# EAGLE design Bench (EAGLE 9.3.1)

## Sheet 1 of 2
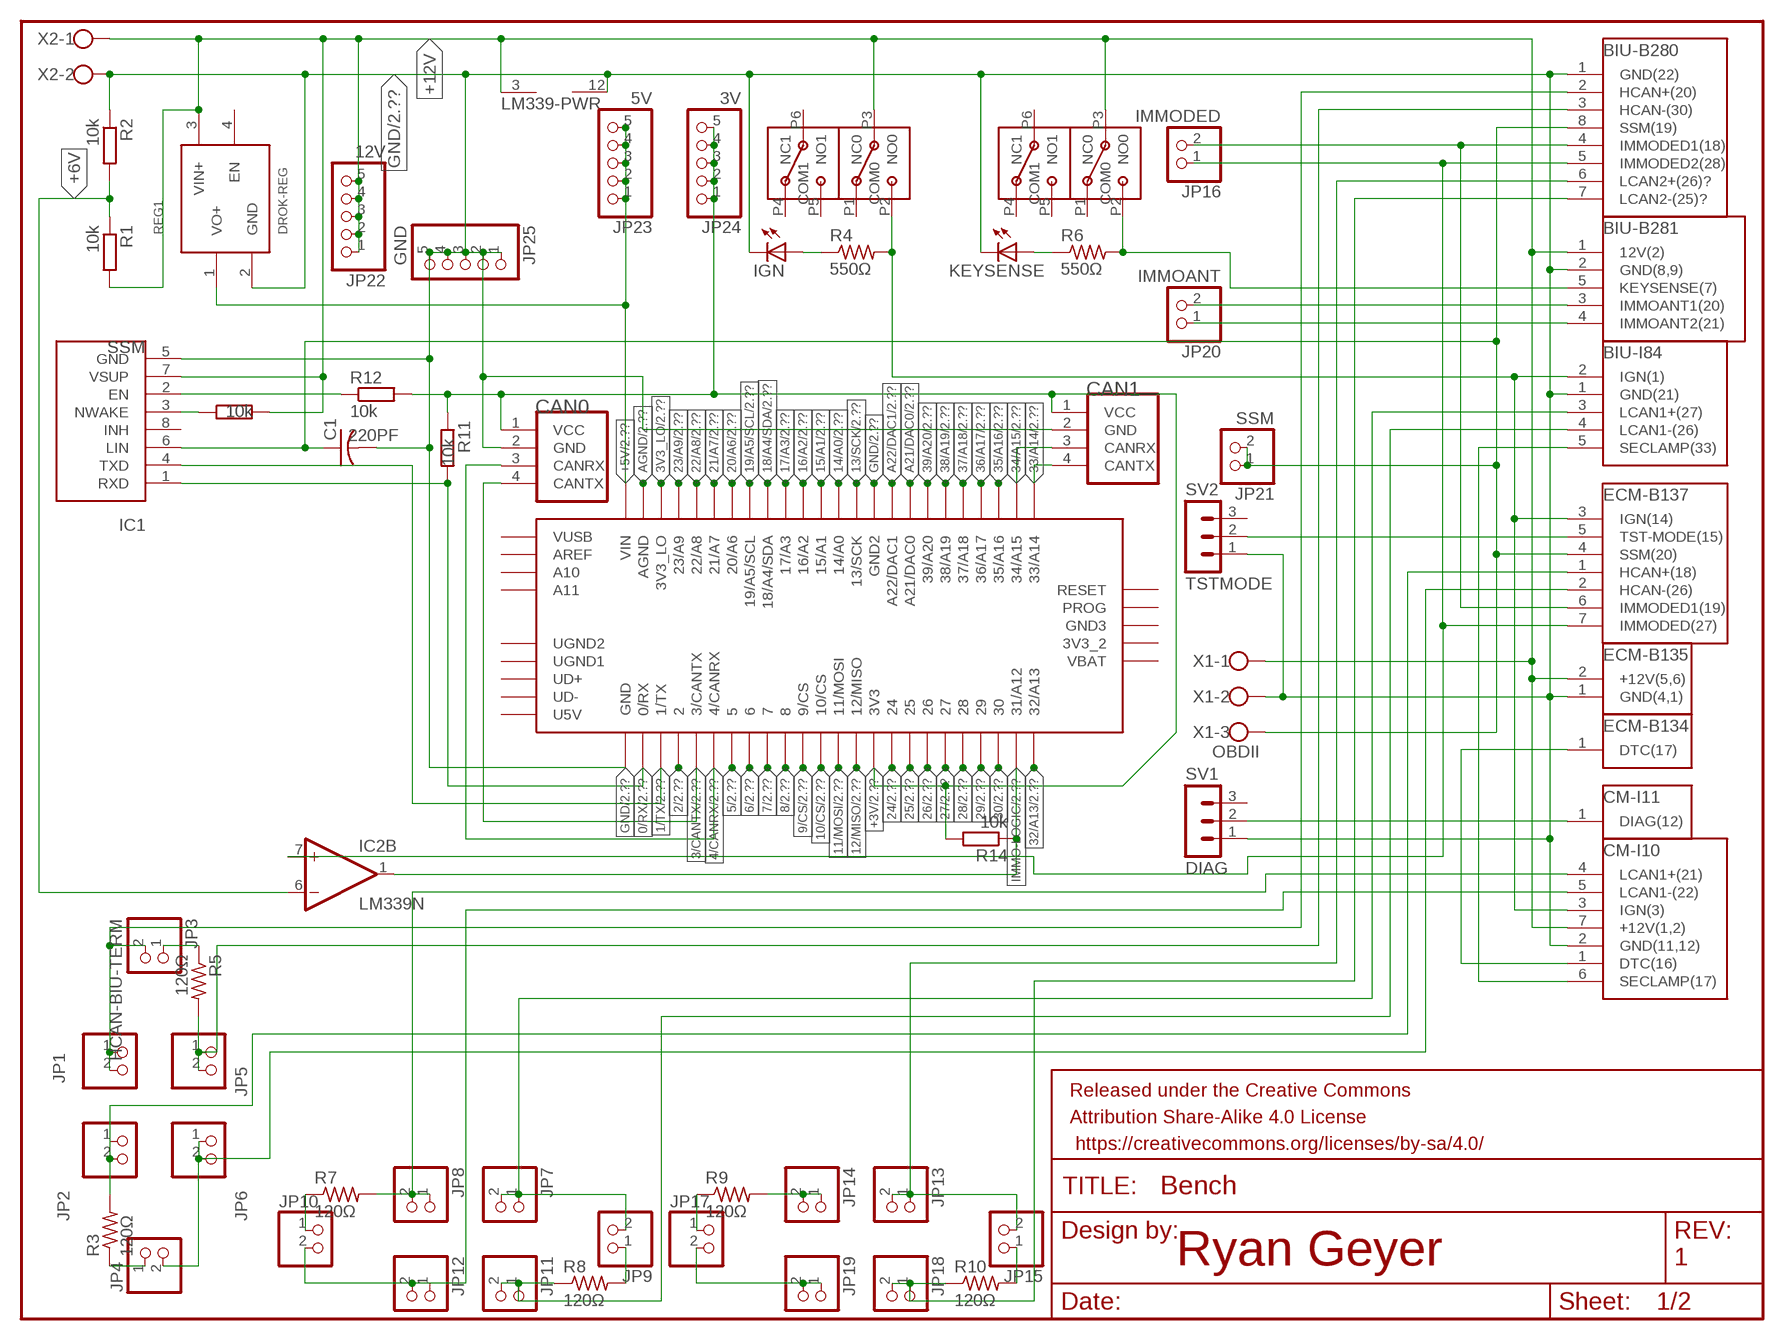
[diagram p0: schematic, sheet 1]

### Parts
C1  220PF  C-US050-024X044  [C050-024X044]
CAN0  SN65HVD230D-BREAKOUT  [1X04]
CAN1  SN65HVD230D-BREAKOUT  [1X04]
CONN1  CM-110  [CM-110]
CONN2  CM-I11  [ECM-B134]
CONN3  BIU-B280  [BIU-B280]
CONN4  BIU-B281  [BIU-B281]
CONN5  BIU-I84  [BIU-I84]
CONN6  ECM-B135  [ECM-B135]
CONN7  ECM-B137  [ECM-B137]
CONN8  ECM-B134  [ECM-B134]
FRAME1  FRAME-LETTER  [CREATIVE_COMMONS]
IC1  SSM  SN65HDVA195-Q1DIL8  [DIL8]
IC2  LM339N  [DIL14]
IGN  LED3MM  [LED3MM]
JP1  PINHD-1X2  [1X02]
JP2  PINHD-1X2  [1X02]
JP3  HCAN-BIU-TERM  PINHD-1X2  [1X02]
JP4  PINHD-1X2  [1X02]
JP5  PINHD-1X2  [1X02]
JP6  PINHD-1X2  [1X02]
JP7  PINHD-1X2  [1X02]
JP8  PINHD-1X2  [1X02]
JP9  PINHD-1X2  [1X02]
JP10  PINHD-1X2  [1X02]
JP11  PINHD-1X2  [1X02]
JP12  PINHD-1X2  [1X02]
JP13  PINHD-1X2  [1X02]
JP14  PINHD-1X2  [1X02]
JP15  PINHD-1X2  [1X02]
JP16  IMMODED  PINHD-1X2  [1X02]
JP17  PINHD-1X2  [1X02]
JP18  PINHD-1X2  [1X02]
JP19  PINHD-1X2  [1X02]
JP20  IMMOANT  PINHD-1X2  [1X02]
JP21  SSM  PINHD-1X2  [1X02]
JP22  12V  PINHD-1X5  [1X05]
JP23  5V  PINHD-1X5  [1X05]
JP24  3V  PINHD-1X5  [1X05]
JP25  GND  PINHD-1X5  [1X05]
KEYSENSE  LED3MM  [LED3MM]
MCU1  TEENSY_3.5/3.6  [TEENSY_3.5/3.6]
R1  10k  R0207/10  [0207/10]
R2  10k  R0207/10  [0207/10]
R3  120Ω  R-US_0207/10  [0207/10]
R4  550Ω  R-US_0207/10  [0207/10]
R5  120Ω  R-US_0207/10  [0207/10]
R6  550Ω  R-US_0207/10  [0207/10]
R7  120Ω  R-US_0207/10  [0207/10]
R8  120Ω  R-US_0207/10  [0207/10]
R9  120Ω  R-US_0207/10  [0207/10]
R10  120Ω  R-US_0207/10  [0207/10]
R11  10k  R0207/10  [0207/10]
R12  10k  R0207/10  [0207/10]
R13  10k  R0207/10  [0207/10]
R14  10k  R0207/10  [0207/10]
REG1  DROK-REG  [DROK-REG]
SV1  DIAG  MA03-1  [MA03-1]
SV2  TSTMODE  MA03-1  [MA03-1]
SW1  8MM-DPDT  [8MM-DPDT]
SW2  8MM-DPDT  [8MM-DPDT]
X1  OBDII  W237-103  [W237-103]
X2  GND  W237-102  [W237-102]

### Nets
0/RX: IC1.1(RXD) MCU1.0/RX R11.2 ; also sheet 2
1/TX: IC1.4(TXD) MCU1.1/TX ; also sheet 2
2: MCU1.2 ; also sheet 2
3/CANTX: CAN0.4(CANTX) MCU1.3/CANTX ; also sheet 2
3V3_LO: MCU1.3V3_LO ; also sheet 2
4/CANRX: CAN0.3(CANRX) MCU1.4/CANRX ; also sheet 2
5: MCU1.5 ; also sheet 2
6: MCU1.6 ; also sheet 2
7: MCU1.7 ; also sheet 2
8: MCU1.8 ; also sheet 2
9/CS: MCU1.9/CS ; also sheet 2
10/CS: MCU1.10/CS ; also sheet 2
11/MOSI: MCU1.11/MOSI ; also sheet 2
12/MISO: MCU1.12/MISO ; also sheet 2
13/SCK: MCU1.13/SCK ; also sheet 2
14/A0: MCU1.14/A0 ; also sheet 2
15/A1: MCU1.15/A1 ; also sheet 2
16/A2: MCU1.16/A2 ; also sheet 2
17/A3: MCU1.17/A3 ; also sheet 2
18/A4/SDA: MCU1.18/A4/SDA ; also sheet 2
19/A5/SCL: MCU1.19/A5/SCL ; also sheet 2
20/A6: MCU1.20/A6 ; also sheet 2
21/A7: MCU1.21/A7 ; also sheet 2
22/A8: MCU1.22/A8 ; also sheet 2
23/A9: MCU1.23/A9 ; also sheet 2
24: MCU1.24 ; also sheet 2
25: MCU1.25 ; also sheet 2
26: MCU1.26 ; also sheet 2
27: MCU1.27 ; also sheet 2
28: MCU1.28 ; also sheet 2
29: MCU1.29 ; also sheet 2
30: MCU1.30 ; also sheet 2
32/A13: MCU1.32/A13 ; also sheet 2
33/A14: CAN1.4(CANTX) MCU1.33/A14 ; also sheet 2
34/A15: CAN1.3(CANRX) MCU1.34/A15 ; also sheet 2
35/A16: MCU1.35/A16 ; also sheet 2
36/A17: MCU1.36/A17 ; also sheet 2
37/A18: MCU1.37/A18 ; also sheet 2
38/A19: MCU1.38/A19 ; also sheet 2
39/A20: MCU1.39/A20 ; also sheet 2
+3V: CAN0.1(VCC) CAN1.1(VCC) JP24.1 JP24.2 JP24.3 JP24.4 JP24.5 MCU1.3V3 R11.1 R12.2 R14.2 ; also sheet 2
+5V: JP23.1 JP23.2 JP23.3 JP23.4 JP23.5 MCU1.VIN REG1.1(VO+) ; also sheet 2
+6V: IC2.6(B:-IN) R1.1 R2.2
+12V: CONN1.7(+12V(1,2)) CONN4.1(12V(2)) CONN6.2(+12V(5,6)) IC1.7(VSUP) IC2.3(P:V+) JP22.1 JP22.2 JP22.3 JP22.4 JP22.5 R1.2 R13.2 REG1.3(VIN+) SW1.P3(COM0) SW2.P3(COM0) X1.1 X2.1
A21/DAC0: MCU1.21/DAC0(A21/DAC0) ; also sheet 2
A22/DAC1: MCU1.A22/DAC1 ; also sheet 2
AGND: MCU1.AGND ; also sheet 2
GND: C1.2 CAN0.2(GND) CAN1.2(GND) CONN1.2(GND(11,12)) CONN3.1(GND(22)) CONN4.2(GND(8,9)) CONN5.1(GND(21)) CONN6.1(GND(4,1)) IC1.5(GND) IC2.12(P:GND) IGN.K(C) JP25.1 JP25.2 JP25.3 JP25.4 JP25.5 KEYSENSE.K(C) MCU1.GND MCU1.GND2 R2.1 REG1.2(GND) SV1.1 SV2.1 X1.2 X2.2 ; also sheet 2
HCAN+(BIU): CONN3.2(HCAN+(20)) JP1.1 JP1.2 JP3.2
HCAN+(ECM): CONN7.1(HCAN+(18)) JP2.1 JP2.2 R3.2
HCAN-(BIU): CONN3.3(HCAN-(30)) JP5.1 JP5.2 R5.2
HCAN-(ECM): CONN7.2(HCAN-(26)) JP4.2 JP6.1 JP6.2
IGN: CONN1.3(IGN(3)) CONN5.2(IGN(1)) CONN7.3(IGN(14)) R4.2 SW1.P2(NO0)
IMMO-LOGIC: IC2.1(B:OUT) MCU1.31/A12 R14.1 ; also sheet 2
KEYSENSE: CONN4.5(KEYSENSE(7)) R6.2 SW2.P2(NO0)
LCAN1+(BIU): CONN5.3(LCAN1+(27)) JP7.1 JP7.2 JP9.2
LCAN1+(CM): CONN1.4(LCAN1+(21)) JP8.1 JP8.2 R7.2
LCAN1-(BIU): CONN5.4(LCAN1-(26)) JP11.1 JP11.2 R8.1
LCAN1-(CM): CONN1.5(LCAN1-(22)) JP10.2 JP12.1 JP12.2
LCAN2+(BIU): CONN3.6(LCAN2+(26)?) JP13.1 JP13.2 JP15.2
LCAN2+(CLI): JP14.1 JP14.2 R9.2
LCAN2-(BIU): CONN3.7(LCAN2-(25)?) JP18.1 JP18.2 R10.1
LCAN2-(CLI): JP17.2 JP19.1 JP19.2
N$2: IGN.A R4.1
N$3: CONN1.6(SECLAMP(17)) CONN5.5(SECLAMP(33))
N$4: KEYSENSE.A R6.1
N$5: CONN1.1(DTC(16)) CONN8.1(DTC(17))
N$6: CONN2.1(DIAG(12)) SV1.2
N$9: JP9.1 R8.2
N$11: JP3.1 R5.1
N$13: JP4.1 R3.1
N$15: JP10.1 R7.1
N$17: JP15.1 R10.2
N$18: IC1.2(EN) R12.1
N$19: IC1.3(NWAKE) R13.1
N$20: JP17.1 R9.1
N$23: CONN3.4(IMMODED1(18)) CONN7.6(IMMODED1(19)) JP16.2
N$24: CONN3.5(IMMODED2(28)) CONN7.7(IMMODED(27)) IC2.7(B:+IN) JP16.1
N$30: CONN4.3(IMMOANT1(20)) JP20.2
N$31: CONN4.4(IMMOANT2(21)) JP20.1
SSM: C1.1 CONN3.8(SSM(19)) CONN7.4(SSM(20)) IC1.6(LIN) JP21.1 JP21.2 X1.3
TSTMODE: CONN7.5(TST-MODE(15)) SV2.2
Unconnected: IC1.8(INH) IC2.2(A:OUT) IC2.4(A:-IN) IC2.5(A:+IN) IC2.8(C:-IN) IC2.9(C:+IN) IC2.10(D:-IN) IC2.11(D:+IN) IC2.13(D:OUT) IC2.14(C:OUT) MCU1.3V3_2 MCU1.A10 MCU1.A11 MCU1.AREF MCU1.GND3 MCU1.PROG MCU1.RESET MCU1.U5V MCU1.UD+ MCU1.UD- MCU1.UGND1 MCU1.UGND2 MCU1.VBAT MCU1.VUSB REG1.4(EN) SV1.3 SV2.3 SW1.P1(NC0) SW1.P4(NC1) SW1.P5(NO1) SW1.P6(COM1) SW2.P1(NC0) SW2.P4(NC1) SW2.P5(NO1) SW2.P6(COM1)

### Notes on the sheet
- LM339-PWR
- Ryan Geyer | 1

## Sheet 2 of 2
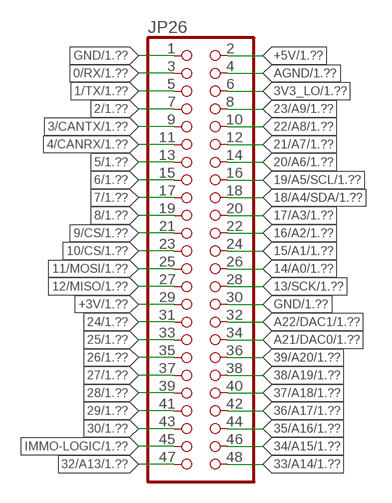
[diagram p1: schematic, sheet 2]

### Parts
JP26  PINHD-2X24  [2X24]

### Nets
0/RX: JP26.3 ; also sheet 1
1/TX: JP26.5 ; also sheet 1
2: JP26.7 ; also sheet 1
3/CANTX: JP26.9 ; also sheet 1
3V3_LO: JP26.6 ; also sheet 1
4/CANRX: JP26.11 ; also sheet 1
5: JP26.13 ; also sheet 1
6: JP26.15 ; also sheet 1
7: JP26.17 ; also sheet 1
8: JP26.19 ; also sheet 1
9/CS: JP26.21 ; also sheet 1
10/CS: JP26.23 ; also sheet 1
11/MOSI: JP26.25 ; also sheet 1
12/MISO: JP26.27 ; also sheet 1
13/SCK: JP26.28 ; also sheet 1
14/A0: JP26.26 ; also sheet 1
15/A1: JP26.24 ; also sheet 1
16/A2: JP26.22 ; also sheet 1
17/A3: JP26.20 ; also sheet 1
18/A4/SDA: JP26.18 ; also sheet 1
19/A5/SCL: JP26.16 ; also sheet 1
20/A6: JP26.14 ; also sheet 1
21/A7: JP26.12 ; also sheet 1
22/A8: JP26.10 ; also sheet 1
23/A9: JP26.8 ; also sheet 1
24: JP26.31 ; also sheet 1
25: JP26.33 ; also sheet 1
26: JP26.35 ; also sheet 1
27: JP26.37 ; also sheet 1
28: JP26.39 ; also sheet 1
29: JP26.41 ; also sheet 1
30: JP26.43 ; also sheet 1
32/A13: JP26.47 ; also sheet 1
33/A14: JP26.48 ; also sheet 1
34/A15: JP26.46 ; also sheet 1
35/A16: JP26.44 ; also sheet 1
36/A17: JP26.42 ; also sheet 1
37/A18: JP26.40 ; also sheet 1
38/A19: JP26.38 ; also sheet 1
39/A20: JP26.36 ; also sheet 1
+3V: JP26.29 ; also sheet 1
+5V: JP26.2 ; also sheet 1
A21/DAC0: JP26.34 ; also sheet 1
A22/DAC1: JP26.32 ; also sheet 1
AGND: JP26.4 ; also sheet 1
GND: JP26.1 JP26.30 ; also sheet 1
IMMO-LOGIC: JP26.45 ; also sheet 1

## Library data of the parts
C1 = adafruit:C-US: CAPACITOR, American symbol
CAN0 CAN1 = SN65HVD230D:SN65HVD230D-BREAKOUT
CONN1 = subieduino-lib:CM-110
CONN2 = subieduino-lib:CM-I11
CONN3 = subieduino-lib:BIU-B280
CONN4 = subieduino-lib:BIU-B281
CONN5 = subieduino-lib:BIU-I84
CONN6 = subieduino-lib:ECM-B135
CONN7 = subieduino-lib:ECM-B137
CONN8 = subieduino-lib:ECM-B134
FRAME1 = SparkFun-Aesthetics:FRAME-LETTER: Schematic Frame - Letter Standard 8.5x11 US Letter frame
IC1 = subieduino-lib:SN65HDVA195-Q1
IC2 = linear3:LM339: Low Power Low Offset Voltage Quad Comparators with open collector; LM139/LM239/LM339/LM2901/LM3302; SPICEPREFIX: J
IGN KEYSENSE = adafruit:LED: LED OSRAM: - CHIPLED LG R971, LG N971, LY N971, LG Q971, LY Q971, LO R971, LY R971 LH N974, LH R974 LS Q976, LO Q976, LY Q976 LO Q996 - Hyper CHIPLED LW Q18S LB Q993, LB Q99A, LB R99A - SideLED LS A670, LO A670, LY A670, LG A670, LP A670 LB A673, LV A673, LT A673, LW A673 LH A674 LY A675 LS A676, LA A676, LO A676, LY A676, LW A676 LS A679, LY A679, LG A679 - Hyper Micro SIDELED® LS Y876, LA Y876, LO Y876, LY Y876 LT Y87S - SmartLED LW L88C, LW L88S LB L89C, LB L89S, LG L890 LS L89K, LO L89K, LY L89K LS L896, LA L896, LO L896, LY L896 - TOPLED LS T670, LO T670, LY T670, LG T670, LP T670 LSG T670, LSP T670, LSY T670, LOP T670, LYG T670 LG T671, LOG T671, LSG T671 LB T673, LV T673, LT T673, LW T673 LH T674 LS T676, LA T676, LO T676, LY T676, LB T676, LH T676, LSB T676, LW T676 LB T67C, LV T67C, LT T67C, LS T67K, LO T67K, LY T67K, LW E67C LS E67B, LA E67B, LO E67B, LY E67B, LB E67C, LV E67C, LT E67C LW T67C LS T679, LY T679, LG T679 LS T770, LO T770, LY T770, LG T770, LP T770 LB T773, LV T773, LT T773, LW T773 LH T774 LS E675, LA E675, LY E675, LS T675 LS T776, LA T776, LO T776, LY T776, LB T776 LHGB T686 LT T68C, LB T68C - Hyper Mini TOPLED® LB M676 - Mini TOPLED Santana® LG M470 LS M47K, LO M47K, LY M47K Source: http://www.osram.convergy.de/
JP1-JP21 = pinhead:PINHD-1X2: PIN HEADER
JP22-JP25 = pinhead:PINHD-1X5: PIN HEADER
JP26 = pinhead:PINHD-2X24: PIN HEADER
MCU1 = Teensy356:TEENSY_3.5/3.6
R1 R2 R11-R14 = eagle-ltspice:R: RESISTOR, European symbol; SPICEMODEL: NONE; SPICEPREFIX: R
R3-R10 = adafruit:R-US_: RESISTOR, American symbol
REG1 = subieduino-lib:DROK-REG
SV1 SV2 = con-lstb:MA03-1: PIN HEADER; OC_FARNELL: unknown; OC_NEWARK: unknown
SW1 SW2 = subieduino-lib:8MM-DPDT
X1 = con-wago-500:W237-103: WAGO SCREW CLAMP; MPN: 237-103; OC_FARNELL: unknown; OC_NEWARK: 18M7116
X2 = con-wago-500:W237-102: WAGO SCREW CLAMP; MPN: 237-102; OC_FARNELL: unknown; OC_NEWARK: 70K9898

## Net classes
0 default: width 0.254 mm

## Board
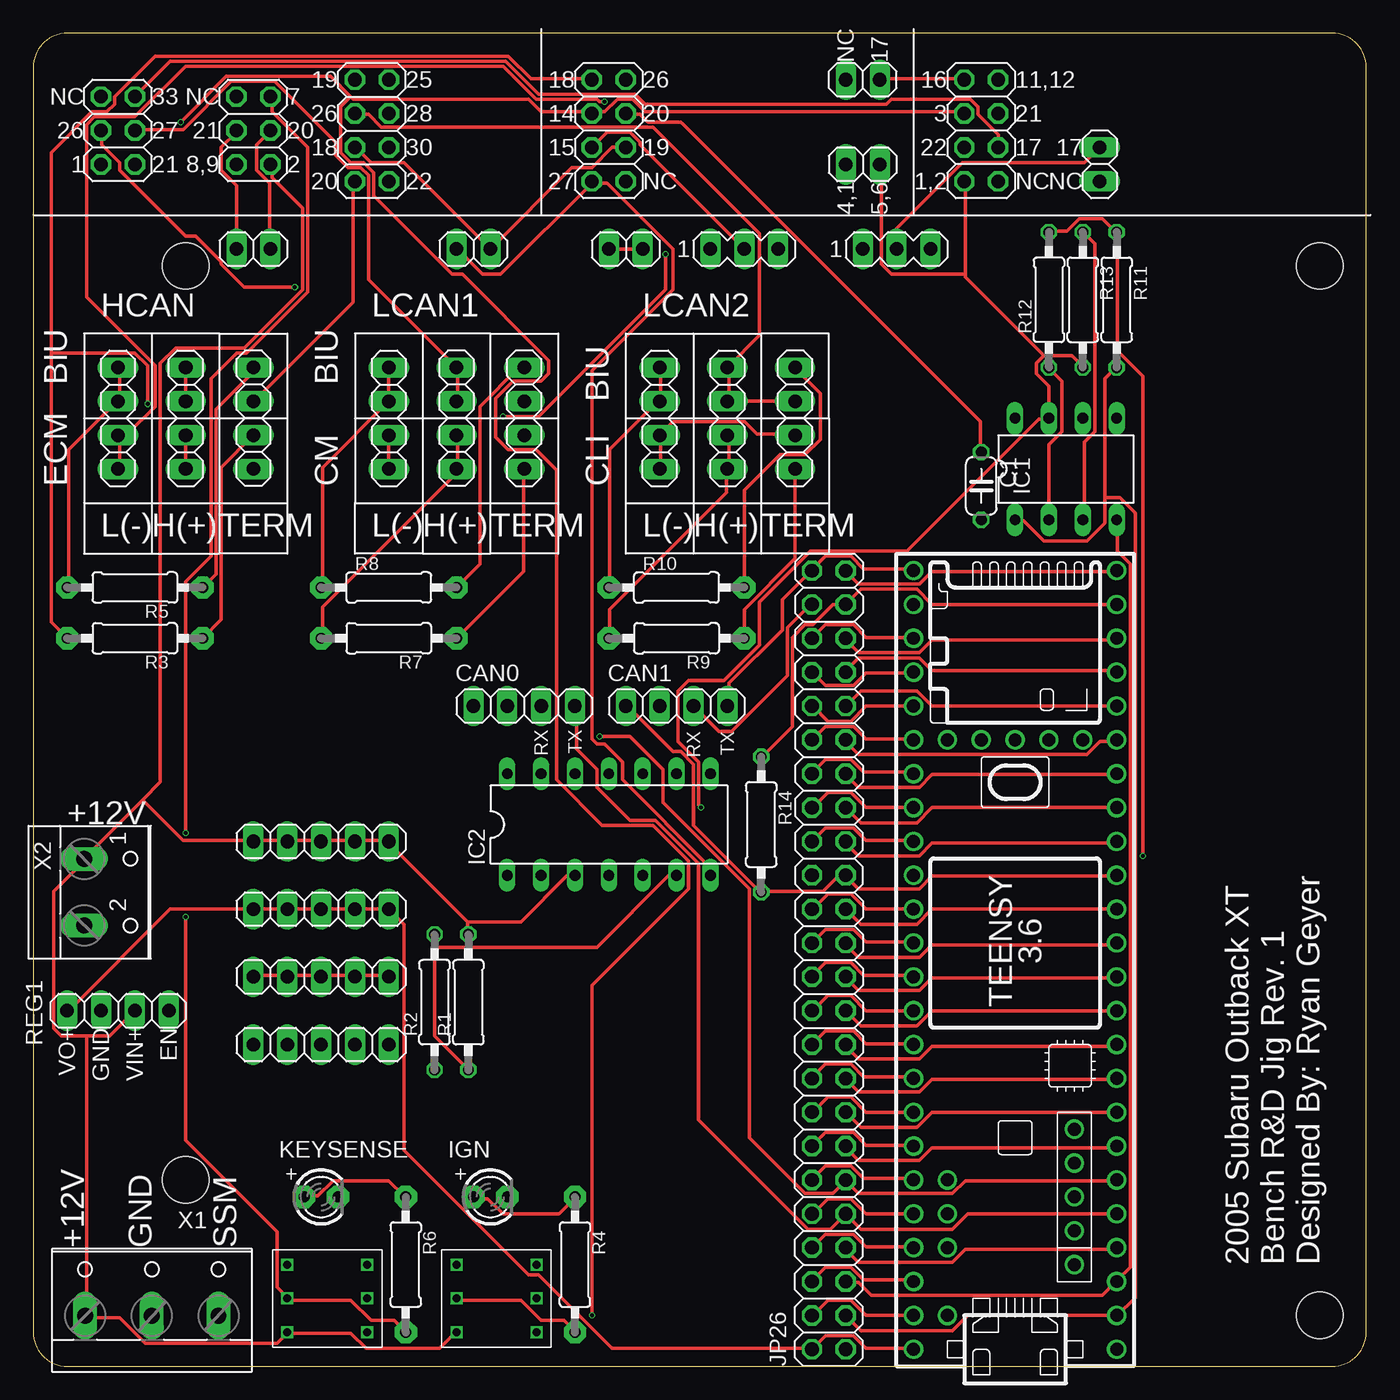
[diagram p2: board, top side]
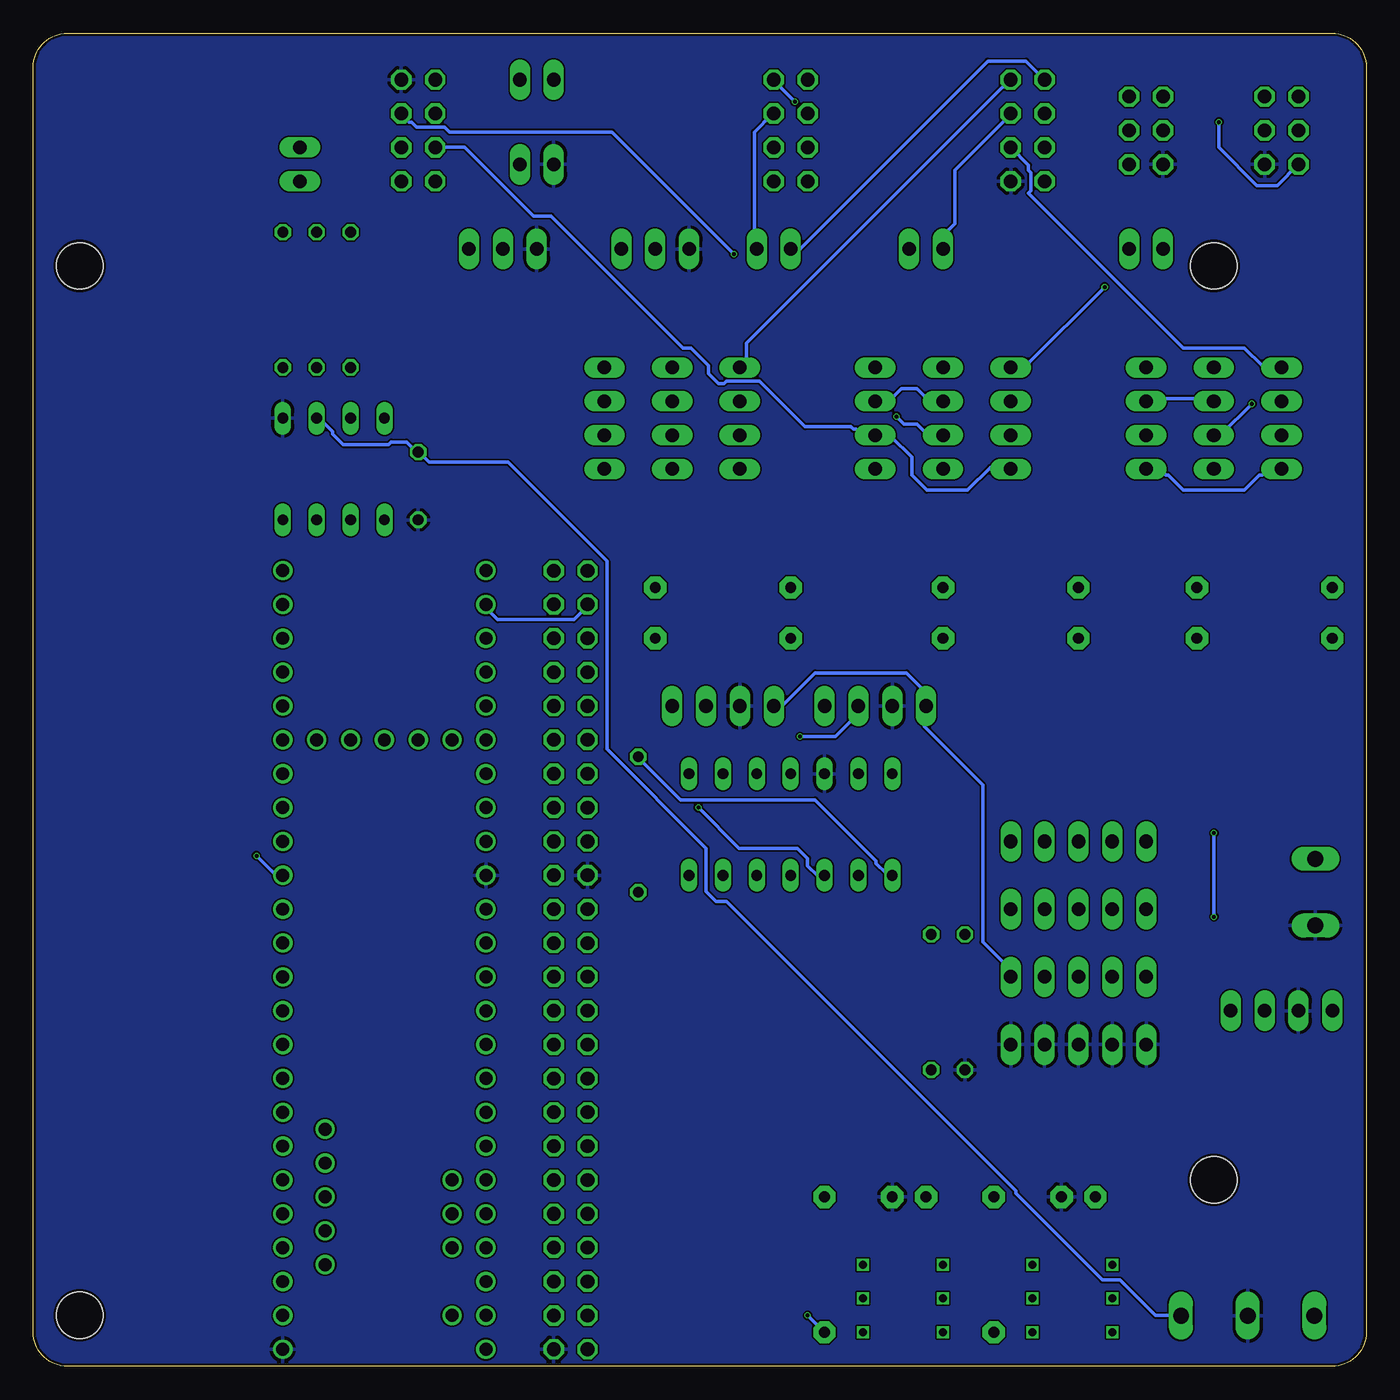
[diagram p3: board, bottom side, seen from below]

Size 100 x 100 mm. Coordinates in mm from the lower left corner, seen from the top.
Outline: 0,97.46 0,2.54 arc90 2.54,0 97.46,0 arc90 100,2.54 100,97.46 arc90 97.46,100 2.54,100 arc90 0,97.46
Copper layers (1*16): Top 0.035559375mm / dielectric 1.6mm / Bottom 0.035559375mm
Design rules "jlcpcb2layer": minimum track width 5mil, minimum drill 12mil, track to track 5mil, track to pad 5mil, pad to pad 5mil, via to via 5mil, smd to smd 5mil, copper to edge 8mil, drill to drill 6mil, minimum pad ring 5mil, minimum via ring 3mil, stop-mask expansion 2.5mil, vias tented up to drill 0mil, thermal gap 10mil
Holes 3.5 mm at 96.52,82.55 96.52,3.81 11.43,13.97 11.43,82.55

### Footprints (pad centres in the part's own frame; a part is rotated, then mirrored left to right if it is on the bottom)
C050-024X044 = drill 0.813 octagon: 1 -2.54,0; 2 2.54,0
1X04 = drill 1.016 long: 1 -3.81,0; 2 -1.27,0; 3 1.27,0; 4 3.81,0
CM-110 = drill 1.016 octagon: 1 -3.81,-1.27; 2 -3.81,1.27; 3 -1.27,-1.27; 4 -1.27,1.27; 5 1.27,-1.27; 6 1.27,1.27; 7 3.81,-1.27; 8 3.81,1.27
ECM-B134 = drill 1.016 long: 1 -1.27,0; 2 1.27,0
BIU-B280 = drill 1.016 octagon: 1 -3.81,-1.27; 2 -3.81,1.27; 3 -1.27,-1.27; 4 -1.27,1.27; 5 1.27,-1.27; 6 1.27,1.27; 7 3.81,-1.27; 8 3.81,1.27
BIU-B281 = drill 1.016 octagon: 1 -2.54,-1.27; 2 -2.54,1.27; 3 0,-1.27; 4 0,1.27; 5 2.54,-1.27; 6 2.54,1.27
BIU-I84 = drill 1.016 octagon: 1 -2.54,-1.27; 2 -2.54,1.27; 3 0,-1.27; 4 0,1.27; 5 2.54,-1.27; 6 2.54,1.27
ECM-B135 = drill 1.016 long: 1 -1.27,0; 2 1.27,0
ECM-B137 = drill 1.016 octagon: 1 -3.81,-1.27; 2 -3.81,1.27; 3 -1.27,-1.27; 4 -1.27,1.27; 5 1.27,-1.27; 6 1.27,1.27; 7 3.81,-1.27; 8 3.81,1.27
DIL8 = drill 0.813 long: 1 -3.81,-3.81; 2 -1.27,-3.81; 3 1.27,-3.81; 4 3.81,-3.81; 5 3.81,3.81; 6 1.27,3.81; 7 -1.27,3.81; 8 -3.81,3.81
DIL14 = drill 0.813 long: 1 -7.62,-3.81; 2 -5.08,-3.81; 3 -2.54,-3.81; 4 0,-3.81; 5 2.54,-3.81; 6 5.08,-3.81; 7 7.62,-3.81; 8 7.62,3.81; 9 5.08,3.81; 10 2.54,3.81; 11 0,3.81; 12 -2.54,3.81; 13 -5.08,3.81; 14 -7.62,3.81
LED3MM = drill 0.813 pad 1.676 octagon: A -1.27,0; K 1.27,0
1X02 = drill 1.016 long: 1 -1.27,0; 2 1.27,0
1X05 = drill 1.016 long: 1 -5.08,0; 2 -2.54,0; 3 0,0; 4 2.54,0; 5 5.08,0
2X24 = drill 1.016 octagon: 1 -27.94,-1.27; 2 -27.94,1.27; 3 -25.4,-1.27; 4 -25.4,1.27; 5 -22.86,-1.27; 6 -22.86,1.27; 7 -20.32,-1.27; 8 -20.32,1.27; 9 -17.78,-1.27; 10 -17.78,1.27; 11 -15.24,-1.27; 12 -15.24,1.27; 13 -12.7,-1.27; 14 -12.7,1.27; 15 -10.16,-1.27; 16 -10.16,1.27; 17 -7.62,-1.27; 18 -7.62,1.27; 19 -5.08,-1.27; 20 -5.08,1.27; 21 -2.54,-1.27; 22 -2.54,1.27; 23 0,-1.27; 24 0,1.27; 25 2.54,-1.27; 26 2.54,1.27; 27 5.08,-1.27; 28 5.08,1.27; 29 7.62,-1.27; 30 7.62,1.27; 31 10.16,-1.27; 32 10.16,1.27; 33 12.7,-1.27; 34 12.7,1.27; 35 15.24,-1.27; 36 15.24,1.27; 37 17.78,-1.27; 38 17.78,1.27; 39 20.32,-1.27; 40 20.32,1.27; 41 22.86,-1.27; 42 22.86,1.27; 43 25.4,-1.27; 44 25.4,1.27; 45 27.94,-1.27; 46 27.94,1.27; 47 30.48,-1.27; 48 30.48,1.27
TEENSY_3.5/3.6 = drill 0.965: 0/RX -25.4,-7.62; 1/TX -22.86,-7.62; 2 -20.32,-7.62; 3/CANTX -17.78,-7.62; 3V3 7.62,-7.62; 3V3_2 17.78,-2.54; 3V3_LO -22.86,7.62; 4/CANRX -15.24,-7.62; 5 -12.7,-7.62; 6 -10.16,-7.62; 7 -7.62,-7.62; 8 -5.08,-7.62; 9/CS -2.54,-7.62; 10/CS 0,-7.62; 11/MOSI 2.54,-7.62; 12/MISO 5.08,-7.62; 13/SCK 5.08,7.62; 14/A0 2.54,7.62; 15/A1 0,7.62; 16/A2 -2.54,7.62; 17/A3 -5.08,7.62; 18/A4/SDA -7.62,7.62; 19/A5/SCL -10.16,7.62; 20/A6 -12.7,7.62; 21/A7 -15.24,7.62; 21/DAC0 12.7,7.62; 22/A8 -17.78,7.62; 23/A9 -20.32,7.62; 24 10.16,-7.62; 25 12.7,-7.62; 26 15.24,-7.62; 27 17.78,-7.62; 28 20.32,-7.62; 29 22.86,-7.62; 30 25.4,-7.62; 31/A12 27.94,-7.62; 32/A13 30.48,-7.62; 33/A14 30.48,7.62; 34/A15 27.94,7.62; 35/A16 25.4,7.62; 36/A17 22.86,7.62; 37/A18 20.32,7.62; 38/A19 17.78,7.62; 39/A20 15.24,7.62; A10 -17.78,5.08; A11 -15.24,5.08; A22/DAC1 10.16,7.62; AGND -25.4,7.62; AREF -20.32,5.08; GND -27.94,-7.62; GND2 7.62,7.62; GND3 17.78,0; PROG 17.78,2.54; RESET 17.78,5.08; U5V -21.59,-4.445; UD+ -16.51,-4.445; UD- -19.05,-4.445; UGND1 -13.97,-4.445; UGND2 -11.43,-4.445; VBAT 17.78,-5.08; VIN -27.94,7.62; VUSB -25.4,5.08
0207/10 = drill 0.813 octagon: 1 -5.08,0; 2 5.08,0
0207/10' = drill 0.813 pad 1.676 octagon: 1 -5.08,0; 2 5.08,0
DROK-REG = drill 1.016 long: 1 -3.81,0; 2 -1.27,0; 3 1.27,0; 4 3.81,0
MA03-1 = drill 1.016 long: 1 -2.54,0; 2 0,0; 3 2.54,0
8MM-DPDT = drill 0.6 square: P1 -3.81,2.54; P2 -3.81,0; P3 -3.81,-2.54; P4 2.19,-2.54; P5 2.19,0; P6 2.19,2.54
W237-103 = drill 1.194 long: 1 -5,-1.29; 2 0,-1.29; 3 5,-1.29
W237-102 = drill 1.194 long: 1 -2.5,-1.27; 2 2.5,-1.27

### Placement (x,y rotation side)
C1  71.12,66.04 270 top
CAN0  36.83,49.53 0 top
CAN1  48.26,49.53 0 top
CONN1  71.12,92.71 270 top
CONN2  80.01,90.17 270 top
CONN3  25.4,92.71 90 top
CONN4  16.51,92.71 90 top
CONN5  6.35,92.71 90 top
CONN6  62.23,90.17 0 top
CONN7  43.18,92.71 270 top
CONN8  62.23,96.52 180 top
FRAME1  20.32,101.6 0 top
IC1  77.47,67.31 0 top
IC2  43.18,40.64 0 top
IGN  34.29,12.7 0 top
JP1  11.43,73.66 90 top
JP2  11.43,68.58 90 top
JP3  16.51,73.66 270 top
JP4  16.51,68.58 270 top
JP5  6.35,73.66 90 top
JP6  6.35,68.58 90 top
JP7  31.75,73.66 270 top
JP8  31.75,68.58 270 top
JP9  36.83,73.66 270 top
JP10  36.83,68.58 90 top
JP11  26.67,73.66 90 top
JP12  26.67,68.58 90 top
JP13  52.07,73.66 90 top
JP14  52.07,68.58 90 top
JP15  57.15,73.66 270 top
JP16  33.02,83.82 0 top
JP17  57.15,68.58 90 top
JP18  46.99,73.66 90 top
JP19  46.99,68.58 90 top
JP20  16.51,83.82 0 top
JP21  44.45,83.82 0 top
JP22  21.59,39.37 0 top
JP23  21.59,34.29 0 top
JP24  21.59,29.21 0 top
JP25  21.59,24.13 0 top
JP26  59.69,29.21 90 top
KEYSENSE  21.59,12.7 0 top
MCU1  73.66,29.21 90 top
R1  32.64,27.3 90 top
R2  30.1,27.3 90 top
R3  120Ω  [0207/10']  7.62,54.61 180 top
R4  550Ω  [0207/10']  40.64,7.62 270 top
R5  120Ω  [0207/10']  7.62,58.42 180 top
R6  550Ω  [0207/10']  27.94,7.62 270 top
R7  120Ω  [0207/10']  26.67,54.61 180 top
R8  120Ω  [0207/10']  26.67,58.42 0 top
R9  120Ω  [0207/10']  48.26,54.61 180 top
R10  120Ω  [0207/10']  48.26,58.42 0 top
R11  81.28,80.01 270 top
R12  76.2,80.01 90 top
R13  78.74,80.01 270 top
R14  54.61,40.64 270 top
REG1  6.35,26.67 0 top
SV1  64.77,83.82 0 top
SV2  53.34,83.82 0 top
SW1  35.56,5.08 0 top
SW2  22.86,5.08 0 top
X1  8.89,5.08 0 top
X2  5.08,35.56 270 top

### Tracks (layer width: path | path; a pad name or v marks a point on that pad's centre or on a via)
0/RX
  Top 0.254: 80.39,65.15 80.39,74.11 81.15,74.87 R11.2 | 80.39,65.15 80.39,63.25 79.06,61.91 75.82,61.91 74.3,63.44 73.72,63.44 IC1.1 | JP26.3 62.1,2.67 68.96,2.67 70.1,3.81 MCU1.0/RX 81.34,3.81 82.68,5.14 82.68,64.01 81.53,65.15 80.39,65.15
1/TX
  Top 0.254: IC1.4 81.34,63.44 81.34,61.15 82.3,60.2 82.3,7.43 81.34,6.48 MCU1.1/TX 81.15,6.29 80.2,5.33 62.87,5.33 61.91,6.29 60.96,6.29 JP26.5
2
  Top 0.254: MCU1.2 81.15,8.76 69.91,8.76 68.96,7.81 61.91,7.81 60.96,8.76 JP26.7
3/CANTX
  Top 0.254: MCU1.3/CANTX 70.1,11.43 68.96,10.29 62.1,10.29 JP26.9 59.82,10.29 58.1,10.29 49.91,18.48 49.91,37.72 46.67,40.96 44.77,40.96 42.29,43.43 42.29,44.77 40.77,46.29 40.77,49.53 CAN0.4
3V3_LO
  Top 0.254: MCU1.3V3_LO 65.91,6.48 62.29,6.48 61.34,7.43 59.44,7.43 58.48,6.48 JP26.6
4/CANRX  (via drill 0.3)
  Top 0.254: 60.96,13.91 61.91,12.95 68.96,12.95 69.91,13.91 81.15,13.91 MCU1.4/CANRX | v42.48,47.24 44.77,47.24 47.24,44.77 47.24,42.29 53.72,35.81 53.72,17.14 57.91,12.95 60.01,12.95 60.96,13.91 | 60.96,13.91 JP26.11
  Bottom 0.254: CAN0.3 38.1,48.96 39.81,47.24 v42.48,47.24
5
  Top 0.254: MCU1.5 81.15,16.38 67.44,16.38 66.48,15.43 61.91,15.43 60.96,16.38 JP26.13
6
  Top 0.254: MCU1.6 67.44,19.05 66.29,17.91 62.1,17.91 JP26.15
7
  Top 0.254: MCU1.7 81.15,21.53 67.44,21.53 66.48,20.57 61.91,20.57 60.96,21.53 JP26.17
8
  Top 0.254: MCU1.8 81.15,24 67.44,24 66.48,23.05 61.91,23.05 60.96,24 JP26.19
9/CS
  Top 0.254: MCU1.9/CS 67.44,26.67 66.29,25.53 62.1,25.53 JP26.21
10/CS
  Top 0.254: MCU1.10/CS 81.15,29.15 67.44,29.15 66.48,28.19 61.91,28.19 60.96,29.15 JP26.23
11/MOSI
  Top 0.254: MCU1.11/MOSI 81.15,31.62 67.44,31.62 66.48,30.67 61.91,30.67 60.96,31.62 JP26.25
12/MISO
  Top 0.254: MCU1.12/MISO 67.44,34.29 66.29,33.15 62.1,33.15 JP26.27
13/SCK
  Top 0.254: MCU1.13/SCK 62.48,34.29 61.34,35.43 59.63,35.43 58.48,34.29 JP26.28
14/A0
  Top 0.254: JP26.26 59.44,32.77 61.53,32.77 62.48,31.81 65.91,31.81 MCU1.14/A0
15/A1
  Top 0.254: MCU1.15/A1 65.91,29.34 62.29,29.34 61.34,30.29 59.44,30.29 58.48,29.34 JP26.24
16/A2
  Top 0.254: MCU1.16/A2 62.48,26.67 61.34,27.81 59.63,27.81 58.48,26.67 JP26.22
17/A3
  Top 0.254: JP26.20 59.44,25.15 61.53,25.15 62.48,24.19 65.91,24.19 MCU1.17/A3
18/A4/SDA
  Top 0.254: MCU1.18/A4/SDA 65.91,21.72 62.29,21.72 61.34,22.67 59.44,22.67 58.48,21.72 JP26.18
19/A5/SCL
  Top 0.254: MCU1.19/A5/SCL 62.48,19.05 61.34,20.19 59.63,20.19 58.48,19.05 JP26.16
20/A6
  Top 0.254: JP26.14 59.44,17.53 61.53,17.53 62.48,16.57 65.91,16.57 MCU1.20/A6
21/A7
  Top 0.254: MCU1.21/A7 65.91,14.1 62.29,14.1 61.34,15.05 59.44,15.05 58.48,14.1 JP26.12
22/A8
  Top 0.254: MCU1.22/A8 62.48,11.43 61.34,12.57 59.63,12.57 58.48,11.43 JP26.10
23/A9
  Top 0.254: JP26.8 59.44,9.91 61.53,9.91 62.48,8.95 65.91,8.95 MCU1.23/A9
24
  Top 0.254: MCU1.24 81.15,39.24 67.44,39.24 66.48,38.29 61.91,38.29 60.96,39.24 JP26.31
25
  Top 0.254: MCU1.25 67.44,41.91 66.29,40.77 62.1,40.77 JP26.33
26
  Top 0.254: MCU1.26 81.15,44.39 67.44,44.39 66.48,43.43 61.91,43.43 60.96,44.39 JP26.35
27
  Top 0.254: MCU1.27 81.15,46.86 80.01,46.86 79.06,45.91 61.91,45.91 60.96,46.86 JP26.37
28
  Top 0.254: MCU1.28 67.44,49.53 66.29,50.67 62.1,50.67 JP26.39
29
  Top 0.254: MCU1.29 81.15,52.2 67.44,52.2 66.48,53.15 61.91,53.15 60.96,52.2 JP26.41
30
  Top 0.254: MCU1.30 81.15,54.48 67.44,54.48 66.48,53.53 61.91,53.53 60.96,54.48 JP26.43
32/A13
  Top 0.254: MCU1.32/A13 81.15,59.63 67.44,59.63 66.48,58.67 61.91,58.67 60.96,59.63 JP26.47
33/A14
  Top 0.254: MCU1.33/A14 65.91,59.82 62.29,59.82 61.34,60.77 59.44,60.77 58.48,59.82 JP26.48 58.29,59.63 56.2,57.53 56.2,55.24 52.2,51.24 52.2,49.53 CAN1.4
34/A15
  Top 0.254: CAN1.3 51.44,47.62 52.39,47.62 56.58,51.82 56.58,55.44 58.29,57.15 JP26.46
  Bottom 0.254: MCU1.34/A15 65.91,57.15 65.91,56.77 65.15,56.01 59.44,56.01 58.29,57.15 JP26.46
35/A16
  Top 0.254: JP26.44 59.44,55.63 61.53,55.63 62.48,54.67 65.91,54.67 MCU1.35/A16
36/A17
  Top 0.254: JP26.42 59.44,51.05 61.53,51.05 62.48,52.01 65.91,52.01 MCU1.36/A17
37/A18
  Top 0.254: MCU1.37/A18 62.48,49.53 61.34,48.39 59.63,48.39 58.48,49.53 JP26.40
38/A19
  Top 0.254: JP26.38 59.44,48.01 61.53,48.01 62.48,47.05 65.91,47.05 MCU1.38/A19
39/A20
  Top 0.254: MCU1.39/A20 65.91,44.58 62.29,44.58 61.34,45.53 59.44,45.53 58.48,44.58 JP26.36
+3V  (via drill 0.3)
  Top 0.254: 19.05,29.34 16.57,29.34 JP24.1 | JP24.5 26.67,29.34 24.19,29.34 JP24.4 24,29.34 21.72,29.34 JP24.3 21.53,29.34 19.05,29.34 | 19.05,29.34 JP24.2 | R12.2 76.2,85.15 77.53,85.15 78.49,86.11 80.2,86.11 81.15,85.15 R11.1 81.34,84.96 81.34,76.2 83.25,74.3 v83.25,38.29 | 60.96,36.77 60.39,36.77 59.24,35.62 54.67,35.62 R14.2 54.48,35.62 49.53,40.58 49.53,45.15 48.58,46.1 48.01,46.1 44.58,49.53 CAN1.1 | 60.96,36.77 61.91,35.81 66.48,35.81 67.44,36.77 81.15,36.77 MCU1.3V3 | 60.96,36.77 JP26.29
  Bottom 0.254: 33.15,49.53 33.15,50.67 34.48,52.01 41.34,52.01 43.81,49.53 CAN1.1 | JP24.5 26.67,29.72 28.77,31.81 28.77,43.62 33.15,48.01 33.15,49.53 | 33.15,49.53 CAN0.1 | v83.25,38.29 81.92,36.96 81.34,36.96 MCU1.3V3
+5V
  Top 0.254: MCU1.VIN 65.91,1.33 62.48,1.33 61.53,2.29 59.44,2.29 JP26.2 58.29,1.33 43.43,1.33 37.91,6.86 37.15,6.86 27.81,16.19 27.81,33.15 JP23.5 JP23.4 JP23.3 JP23.2 JP23.1 10.29,34.29 2.67,26.67 REG1.1
+6V
  Top 0.254: 30.1,31.43 30.1,24.77 R1.1 | 30.1,31.43 R2.2 | 30.1,31.43 42.29,31.43 47.62,36.77 48.2,36.77 IC2.6
+12V  (via drill 0.3)
  Top 0.254: 75.82,75.82 75.25,75.25 75.25,74.49 76.2,73.53 IC1.7 76.2,71.06 75.44,71.06 65.53,61.15 58.29,61.15 54.48,57.34 54.48,54.1 51.82,51.44 49.15,51.44 48.39,50.67 48.39,46.86 49.91,45.34 49.91,42.1 v50.1,41.91 | 75.82,75.82 77.92,75.82 78.68,75.06 R13.2 | 69.91,81.92 69.91,81.72 75.82,75.82 | 69.91,81.92 69.91,88.77 CONN1.7 | 69.91,81.92 64.39,81.92 63.63,82.68 63.63,90.11 CONN6.2 | 19.05,39.43 16.57,39.43 JP22.1 16.38,39.43 11.24,39.43 8.19,42.48 | 19.05,39.43 21.53,39.43 JP22.3 21.72,39.43 24,39.43 JP22.4 24.19,39.43 26.67,39.43 JP22.5 26.67,39.24 32.58,33.34 | 19.05,39.43 JP22.2 | 32.58,33.34 32.58,32.38 R1.2 | 32.58,33.34 36.58,33.34 40.01,36.77 40.58,36.77 IC2.3 | 19.05,2.48 23.81,2.48 24.96,1.33 30.48,1.33 31.62,2.48 SW1.P3 | 19.05,2.48 18.29,1.71 8.38,1.71 6.48,3.62 4,3.62 X1.1 4,3.81 4,24.77 | 19.05,2.48 SW2.P3 | REG1.3 5.71,24.77 4,24.77 | 4,24.77 2.1,24.77 1.52,25.34 1.52,35.62 3.81,37.91 X2.1 3.81,38.1 8.19,42.48 | 8.19,42.48 9.53,43.81 9.53,75.25 10.67,76.39 15.81,76.39 20.19,80.77 20.19,86.87 17.91,89.15 17.91,90.11 CONN4.1
  Bottom 0.254: v50.1,41.91 47.05,38.86 42.67,38.86 41.91,38.1 41.91,37.53 41.15,36.77 40.77,36.77 IC2.3
A21/DAC0
  Top 0.254: MCU1.21/DAC0 62.48,41.91 61.34,43.05 59.63,43.05 58.48,41.91 JP26.34
A22/DAC1
  Top 0.254: JP26.32 59.44,40.39 61.53,40.39 62.48,39.43 65.91,39.43 MCU1.A22/DAC1
AGND
  Top 0.254: MCU1.AGND 62.48,3.81 61.34,4.95 59.63,4.95 58.48,3.81 JP26.4
GND
  pour Bottom: 0,100.33 100.33,100.33 100.33,0 0,0
HCAN+(BIU)
  Top 0.254: JP1.2 JP1.1 | CONN3.2 24,88.77 24,79.82 16.57,72.39 JP3.2
  Bottom 0.254: JP3.2 15.24,72.39 15.05,72.58 11.62,72.58 JP1.1
HCAN+(ECM)  (via drill 0.3)
  Top 0.254: JP2.2 JP2.1 | 1.33,76.01 1.33,55.82 R3.2 | 1.33,76.01 1.33,91.06 4.38,94.11 5.52,94.11 6.1,94.68 6.1,95.25 9.14,98.3 35.62,98.3 37.34,96.58 41.91,96.58 CONN7.1 | v8.57,72.2 8.57,75.06 7.62,76.01 1.33,76.01
  Bottom 0.254: v8.57,72.2 10.86,69.91 11.43,69.91 JP2.2
HCAN-(BIU)
  Top 0.254: JP5.2 6.48,74.87 6.48,72.39 JP5.1 6.29,72.39 2.67,68.77 2.67,58.48 R5.2
  Bottom 0.254: CONN3.3 25.34,90.11 25.34,89.72 25.15,89.53 25.15,88.2 25.34,88.01 13.72,76.39 9.14,76.39 7.81,75.06 6.48,75.06 JP5.2
HCAN-(ECM)  (via drill 0.3)
  Top 0.254: JP6.1 6.48,67.44 6.48,69.72 JP6.2 6.48,69.91 7.05,69.91 9.14,72.01 9.14,75.06 4,80.2 4,93.15 4.57,93.73 7.62,93.73 11.43,97.54 35.24,97.54 37.72,95.06 42.29,95.06 42.48,94.87 v42.86,94.87
  Bottom 0.254: JP4.2 16.38,67.25 15.43,67.25 15.05,66.86 14.86,66.86 13.72,65.72 9.14,65.72 8,66.86 7.81,66.86 7.43,67.25 6.48,67.25 JP6.1 | v42.86,94.87 44.39,96.39 CONN7.2
IGN  (via drill 0.3)
  Top 0.254: SW1.P2 31.81,4.95 36.58,4.95 38.1,3.43 39.81,3.43 40.58,2.67 R4.2 | v11.05,93.34 14.48,96.77 22.29,96.77 23.81,95.25 | 23.81,95.25 24,95.06 37.15,95.06 38.1,94.11 41.91,94.11 | 41.91,94.11 42.86,94.11 43.81,95.06 44.96,95.06 45.91,94.11 69.72,94.11 CONN1.3 | 41.91,94.11 CONN7.3 | v41.91,3.81 41.91,28.57 49.15,35.81 49.15,37.91 46.48,40.58 42.67,40.58 39.24,44.01 39.24,67.25 37.72,68.77 35.62,68.77 34.67,69.72 34.67,72.58 36.01,73.91 38.1,73.91 38.67,74.49 38.67,75.44 32.19,81.92 31.43,81.92 25.53,87.82 25.53,89.53 24.77,90.3 23.81,90.3 23.05,91.06 23.05,94.49 23.81,95.25
  Bottom 0.254: CONN5.2 6.67,88.58 8.19,88.58 11.05,91.44 v11.05,93.34 | v41.91,3.81 R4.2
IMMO-LOGIC
  Top 0.254: MCU1.31/A12 67.44,57.15 66.29,58.29 62.1,58.29 JP26.45 60.01,57.15 58.48,55.63 57.91,55.63 56.96,54.67 56.96,48.01 54.67,45.72 R14.1
  Bottom 0.254: IC2.1 35.62,36.96 36.01,36.96 36.77,37.72 36.77,37.91 41.34,42.48 51.44,42.48 54.67,45.72 R14.1
KEYSENSE  (via drill 0.3)
  Top 0.254: R6.2 27.05,3.43 25.34,3.43 23.81,4.95 19.05,4.95 SW2.P2 19.05,5.14 18.29,5.91 18.29,10.1 11.43,16.95 v11.43,33.72 | v11.43,40.01 11.43,58.86 13.34,60.77 13.34,74.11 15.24,76.01 16,76.01 20.57,80.58 20.57,91.44 17.91,94.11 17.91,95.25 CONN4.5
  Bottom 0.254: v11.43,33.72 v11.43,40.01
LCAN1+(BIU)
  Top 0.254: JP7.2 31.81,72.39 31.81,74.87 JP7.1 25.15,81.53 25.15,89.34 24.57,89.92 23.62,89.92 22.67,90.87 22.67,91.82 18.1,96.39 14.86,96.39 11.24,92.77 7.62,92.77 CONN5.3
  Bottom 0.254: JP9.2 35.81,72.39 34.86,73.34 33.72,73.34 32.77,72.39 JP7.2
LCAN1+(CM)  (via drill 0.3)
  Top 0.254: JP8.1 31.81,69.72 31.81,67.44 JP8.2 31.62,67.25 31.62,66.86 21.72,56.96 21.72,54.67 R7.2 | v47.43,83.44 47.43,80.77 37.91,71.25 v35.24,71.25
  Bottom 0.254: v47.43,83.44 56.58,92.58 68.77,92.58 69.15,92.96 71.25,92.96 71.63,93.34 71.82,93.34 72.39,93.92 CONN1.4 | v35.24,71.25 34.67,70.67 33.72,70.67 32.96,69.91 31.81,69.91 JP8.1
LCAN1-(BIU)  (via drill 0.3)
  Top 0.254: JP11.2 JP11.1 21.72,67.44 21.72,58.48 R8.1 | v19.62,80.96 15.81,80.96 14.1,82.68 14.1,82.87 12.19,84.77 11.43,84.77 6.48,89.72 6.48,90.3 5.14,91.63 5.14,92.58 CONN5.4
  Bottom 0.254: v19.62,80.96 25.53,75.06 26.67,75.06 JP11.2
LCAN1-(CM)
  Top 0.254: JP12.2 JP12.1
  Bottom 0.254: JP12.1 26.67,67.44 28.19,67.44 29.91,65.72 32.96,65.72 34.1,66.86 34.1,68.2 35.62,69.72 36.77,69.72 JP10.2 36.96,69.91 37.91,69.91 38.29,70.29 38.48,70.29 38.67,70.48 42.1,70.48 45.53,73.91 48.01,73.91 48.2,73.72 48.58,73.72 49.34,74.49 49.34,75.06 50.67,76.39 51.24,76.39 61.15,86.3 62.48,86.3 67.63,91.44 CONN1.5
LCAN2+(BIU)
  Top 0.254: 52.2,72.39 52.2,74.87 JP13.2 54.48,77.34 54.48,84.96 46.48,92.96 26.1,92.96 25.15,93.92 24.19,93.92 CONN3.6 | 52.2,72.39 JP15.2 | 52.2,72.39 JP13.1
LCAN2+(CLI)
  Top 0.254: JP14.2 52.2,69.72 52.2,67.44 JP14.1 52.01,67.25 52.01,65.53 43.24,56.77 43.24,54.67 R9.2
LCAN2-(BIU)
  Top 0.254: JP18.2 47.05,74.87 47.05,72.39 JP18.1 46.86,72.39 43.24,68.77 43.24,58.48 R10.1
  Bottom 0.254: JP18.2 46.48,75.44 46.48,76.77 27.24,96.01 27.05,96.01 26.67,96.39 CONN3.7
LCAN2-(CLI)
  Top 0.254: JP19.1 47.05,67.44 47.05,69.72 JP19.2 48.01,70.87 53.34,70.87 54.29,69.91 57.15,69.91 JP17.2
N$2
  Top 0.254: IGN.A 33.15,12.57 34.1,12.57 35.24,11.43 39.43,11.43 40.58,12.57 R4.1
N$3
  Top 0.254: CONN1.6 72.39,92.39 70.87,93.92 70.87,94.49 70.29,95.06 64.39,95.06 64.01,94.68 45.91,94.68 45.15,95.44 37.91,95.44 35.43,97.92 10.29,97.92 CONN5.5
N$4
  Top 0.254: KEYSENSE.A 20.38,12.76 21.34,12.76 22.48,13.91 26.67,13.91 27.81,12.76 R6.1
N$5
  Top 0.254: CONN8.1 63.63,96.58 69.72,96.58 CONN1.1
N$6
  Top 0.254: SV1.2 64.77,85.34 69.72,90.3 78.87,90.3 CONN2.1
N$9
  Top 0.254: R8.2 33.53,60.2 33.53,72.01 36.39,74.87 36.77,74.87 JP9.1
N$11
  Top 0.254: R5.1 13.72,59.44 13.72,71.82 16.38,74.49 16.38,74.87 JP3.1
N$13
  Top 0.254: JP4.1 14.1,67.44 14.1,56.01 R3.1
N$15
  Top 0.254: R7.1 36.77,59.63 36.77,67.25 JP10.1
N$17
  Top 0.254: R10.2 53.34,65.72 56.01,68.39 57.91,68.39 59.05,69.53 59.05,72.96 57.15,74.87 JP15.1
N$18
  Top 0.254: IC1.2 76.2,69.15 77.15,70.1 77.15,73.91 76.2,74.87 R12.1
N$19
  Top 0.254: R13.1 79.63,84.2 79.63,70.1 78.87,69.34 78.87,63.63 IC1.3
N$20
  Top 0.254: JP17.1 57.15,60.58 53.34,56.77 R9.1
N$23
  Top 0.254: CONN3.4 24.19,91.44 25.34,90.3 27.81,90.3 JP16.2 40.39,89.92 41.91,89.92 43.43,91.44 CONN7.6
N$24
  Top 0.254: 41.91,88.77 43.05,88.77 48.01,83.82 48.01,80.77 41.91,74.68 41.91,47.05 42.29,46.67 42.86,46.67 44.2,45.34 44.2,44.01 50.67,37.53 50.67,36.96 IC2.7 | 41.91,88.77 35.05,81.92 33.72,81.92 31.81,83.82 JP16.1 | 41.91,88.77 CONN7.7
  Bottom 0.254: CONN3.5 26.67,93.92 30.86,89.72 30.86,85.72 31.62,84.96 31.62,83.82 JP16.1
N$30
  Top 0.254: JP20.2 17.72,83.82 17.72,88.77 16.76,89.72 16.76,91.63 17.72,92.58 CONN4.3
N$31
  Top 0.254: JP20.1 15.24,88.58 14.1,89.72 14.1,91.44 15.24,92.58 CONN4.4
SSM
  Top 0.254: JP21.2 JP21.1 | CONN7.4 44.58,93.92 45.53,93.92 46.1,93.34 48.58,93.34 71.06,70.87 71.06,68.58 C1.1
  Bottom 0.254: JP21.2 45.91,84.01 45.91,92.58 44.58,93.92 CONN7.4 | CONN3.8 25.53,97.92 28.38,97.92 42.48,83.82 JP21.1 | IC1.6 78.68,71.25 77.53,70.1 77.53,69.91 76.77,69.15 73.34,69.15 73.15,69.34 72.01,69.34 71.25,68.58 C1.1 71.06,68.58 70.29,67.82 64.39,67.82 56.96,60.39 56.96,46.29 49.53,38.86 49.53,35.62 48.77,34.86 48.01,34.86 26.29,13.14 26.29,12.95 19.81,6.48 18.48,6.48 15.81,3.81 13.91,3.81 X1.3
TSTMODE
  Top 0.254: SV2.2 45.53,91.63 45.53,91.82 44.77,92.58 43.05,92.58 CONN7.5

### Text on the board
tNames: HCAN | LCAN1 | LCAN2 | BIU | BIU | BIU | ECM | CM | CLI | L(-) | H(+) | TERM | L(-) | H(+) | TERM | L(-) | H(+) | TERM | RX | TX | RX | TX | +12V | +12V | GND | SSM | 2005 Subaru Outback XT / Bench R&D Jig Rev. 1 / Designed By: Ryan Geyer